# EAGLE design charging_test (EAGLE 5.11)
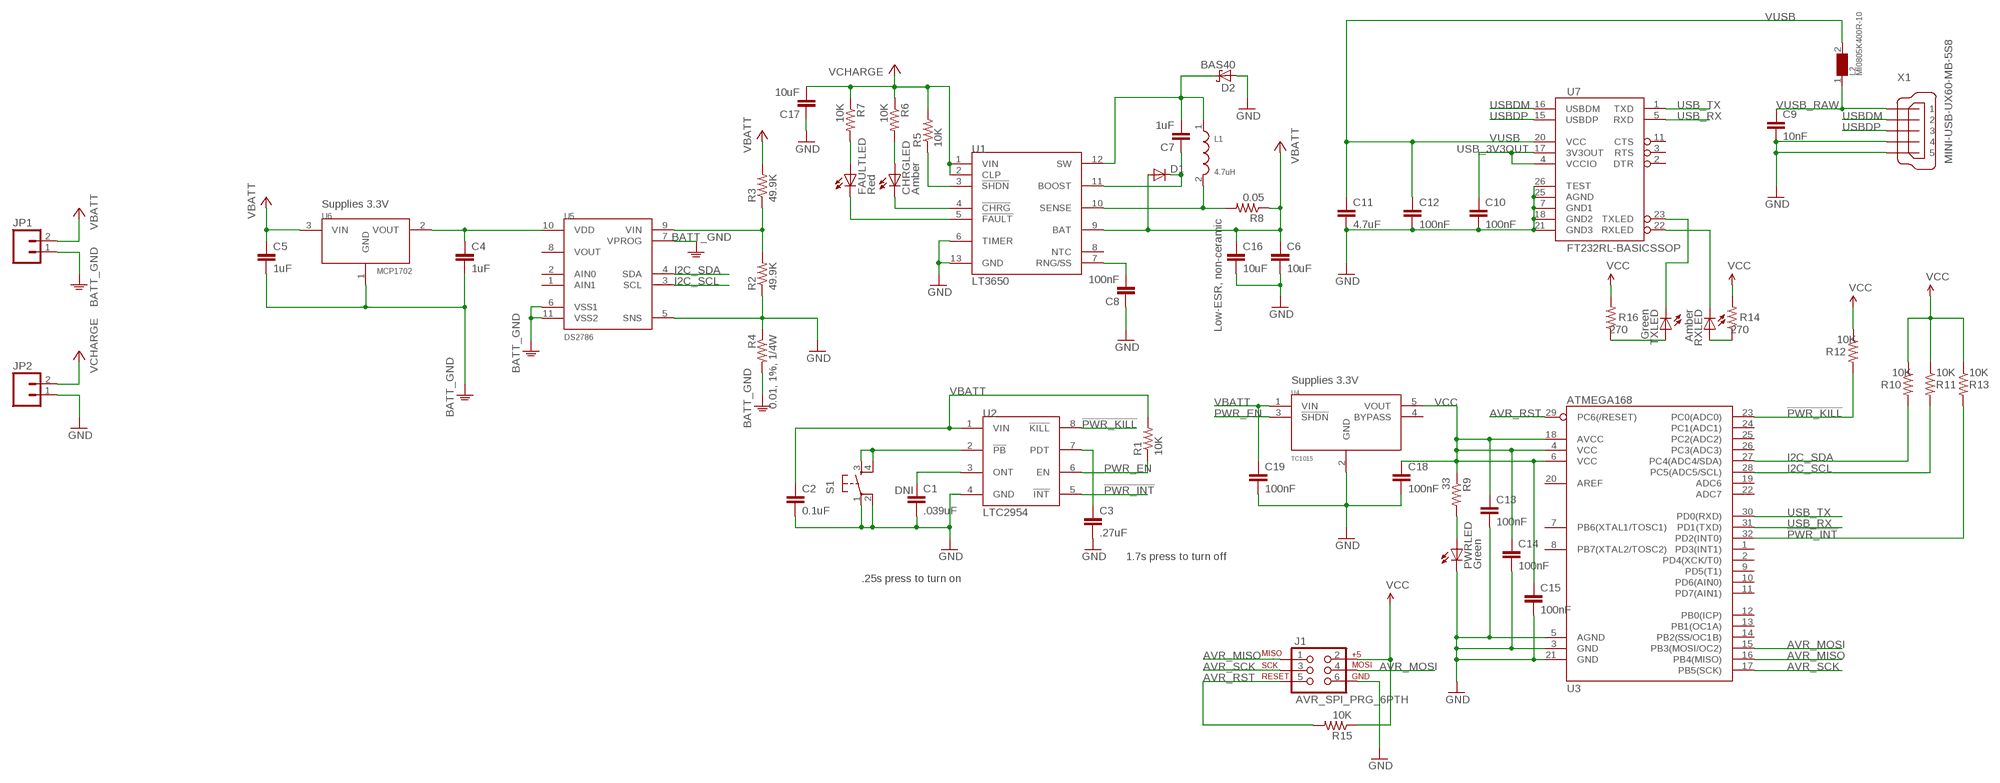
[diagram p0: schematic, sheet 1]

## Parts
C1  .039uF  CAP0603-CAP  [0603-CAP]
C2  0.1uF  CAP0603-CAP  [0603-CAP]
C3  .27uF  CAP0603-CAP  [0603-CAP]
C4  1uF  CAP0603-CAP  [0603-CAP]
C5  1uF  CAP0603-CAP  [0603-CAP]
C6  10uF  CAP0603-CAP  [0603-CAP]
C7  1uF  CAP0603-CAP  [0603-CAP]
C8  100nF  CAP0603-CAP  [0603-CAP]
C9  10nF  CAP0603-CAP  [0603-CAP]
C10  100nF  CAP0603-CAP  [0603-CAP]
C11  4.7uF  CAP0603-CAP  [0603-CAP]
C12  100nF  CAP0603-CAP  [0603-CAP]
C13  100nF  CAP0603-CAP  [0603-CAP]
C14  100nF  CAP0603-CAP  [0603-CAP]
C15  100nF  CAP0603-CAP  [0603-CAP]
C16  10uF  CAP0603-CAP  [0603-CAP]
C17  10uF  CAP0603-CAP  [0603-CAP]
C18  100nF  CAP0603-CAP  [0603-CAP]
C19  100nF  CAP0603-CAP  [0603-CAP]
CHRGLED  Amber  LED0603  [LED-0603]
D1  DIODESMA  [SMA-DIODE]
D2  BAS40  [SOT23]
FAULTLED  Red  LED0603  [LED-0603]
J1  AVR_SPI_PRG_6PTH  [2X3]
JP1  M02LOCK  [1X02_LOCK]
JP2  M02LOCK  [1X02_LOCK]
L1  4.7uH  MPI4040  [MPI4040]
L2  MI0805K400R-10  [0805]
PWRLED  Green  LED0603  [LED-0603]
R1  10K  RESISTOR0603-RES  [0603-RES]
R2  49.9K  RESISTOR0603-RES  [0603-RES]
R3  49.9K  RESISTOR0603-RES  [0603-RES]
R4  0.01, 1%, 1/4W  RESISTOR  [0805]
R5  10K  RESISTOR0603-RES  [0603-RES]
R6  10K  RESISTOR0603-RES  [0603-RES]
R7  10K  RESISTOR0603-RES  [0603-RES]
R8  0.05  RESISTOR0603-RES  [0603-RES]
R9  33  RESISTOR0603-RES  [0603-RES]
R10  10K  RESISTOR0603-RES  [0603-RES]
R11  10K  RESISTOR0603-RES  [0603-RES]
R12  10K  RESISTOR0603-RES  [0603-RES]
R13  10K  RESISTOR0603-RES  [0603-RES]
R14  270  RESISTOR0603-RES  [0603-RES]
R15  10K  RESISTOR0603-RES  [0603-RES]
R16  270  RESISTOR0603-RES  [0603-RES]
RXLED  Amber  LED0603  [LED-0603]
S1  TAC_SWITCHSMD  [TACTILE_SWITCH_SMD]
TXLED  Green  LED0603  [LED-0603]
U1  LT3650  [12-MSOP]
U2  LTC2954  [8-TSOT23]
U3  ATMEGA168  [TQFP32-08]
U4  TC1015  [5-SOT23]
U5  DS2786  [10-TDFN]
U6  MCP1702  [SOT23]
U7  FT232RL-BASICSSOP  [SSOP28DB]
X1  MINI-USB-UX60-MB-5S8  [UX60-MB-5S8]

## Nets
!PWR_INT: R13.2 U2.5(!INT) U3.32(PD2(INT0))
!PWR_KILL: R12.2 U2.8(!KILL) U3.23(PC0(ADC0))
AVR_MISO: J1.1 U3.16(PB4(MISO))
AVR_MOSI: J1.4 U3.15(PB3(MOSI/OC2))
AVR_RST: J1.5 R15.2 U3.29(PC6(/RESET))
AVR_SCK: J1.3 U3.17(PB5(SCK))
BATT_GND: C4.2 C5.2 JP1.1 R4.2 U5.6(VSS1) U5.7(VPROG) U5.11(VSS2) U6.1(GND)
GND: C1.2 C2.2 C3.2 C6.2 C8.1 C9.2 C10.2 C11.2 C12.2 C13.2 C14.2 C15.2 C16.2 C17.1 C18.2 C19.2 D2.1(A) J1.6 JP2.1 PWRLED.C R2.1 R4.1 S1.1 S1.2 U1.6(TIMER) U1.13(GND) U2.4(GND) U3.3(GND) U3.5(AGND) U3.21(GND) U4.2(GND) U5.5(SNS) U7.7(GND1) U7.18(GND2) U7.21(GND3) U7.25(AGND) U7.26(TEST) X1.4 X1.5
I2C_SCL: R11.2 U3.28(PC5(ADC5/SCL)) U5.3(SCL)
I2C_SDA: R10.2 U3.27(PC4(ADC4/SDA)) U5.4(SDA)
N$1: PWRLED.A R9.2
N$2: S1.3 S1.4 U2.2(!PB)
N$3: C4.1 U5.10(VDD) U6.2(VOUT)
N$4: C1.1 U2.3(ONT)
N$5: R2.2 R3.1 U5.9(VIN)
N$6: C7.1 D1.C U1.11(BOOST)
N$7: C3.1 U2.7(PDT)
N$8: R16.1 TXLED.A
N$9: FAULTLED.A R7.2
N$10: R14.1 RXLED.A
N$11: C7.2 D2.3(C) L1.1 U1.12(SW)
N$12: CHRGLED.C U1.4(!CHRG)
N$13: CHRGLED.A R6.2
N$14: C8.2 U1.7(RNG/SS)
N$15: R5.1 U1.3(!SHDN)
N$16: FAULTLED.C U1.5(!FAULT)
N$18: TXLED.C U7.23(TXLED)
N$19: RXLED.C U7.22(RXLED)
PWR_EN: R1.1 U2.6(EN) U4.3(!SHDN)
SENSE: L1.2 R8.2 U1.10(SENSE)
USB_3V3OUT: C10.1 U7.4(VCCIO) U7.17(3V3OUT)
USB_RX: U3.31(PD1(TXD)) U7.5(RXD)
USB_TX: U3.30(PD0(RXD)) U7.1(TXD)
USBDM: U7.16(USBDM) X1.2
USBDP: U7.15(USBDP) X1.3
VBATT: C2.1 C5.1 C6.1 C16.1 C19.1 D1.A JP1.2 R1.2 R3.2 R8.1 U1.9(BAT) U2.1(VIN) U4.1(VIN) U6.3(VIN)
VCC: C13.1 C14.1 C15.1 C18.1 J1.2 R9.1 R10.1 R11.1 R12.1 R13.1 R14.2 R15.1 R16.2 U3.4(VCC) U3.6(VCC) U3.18(AVCC) U4.5(VOUT)
VCHARGE: C17.2 JP2.2 R5.2 R6.1 R7.1 U1.1(VIN) U1.2(CLP)
VUSB: C11.1 C12.1 L2.2 U7.20(VCC)
VUSB_RAW: C9.1 L2.1 X1.1
Unconnected: U1.8(NTC) U3.1(PD3(INT1)) U3.2(PD4(XCK/T0)) U3.7(PB6(XTAL1/TOSC1)) U3.8(PB7(XTAL2/TOSC2)) U3.9(PD5(T1)) U3.10(PD6(AIN0)) U3.11(PD7(AIN1)) U3.12(PB0(ICP)) U3.13(PB1(OC1A)) U3.14(PB2(SS/OC1B)) U3.19(ADC6) U3.20(AREF) U3.22(ADC7) U3.24(PC1(ADC1)) U3.25(PC2(ADC2)) U3.26(PC3(ADC3)) U4.4(BYPASS) U5.1(AIN1) U5.2(AIN0) U5.8(VOUT) U7.2(DTR) U7.3(RTS) U7.11(CTS)

## Notes on the sheet
- Supplies 3.3V
- Low-ESR, non-ceramic
- Supplies 3.3V
- DNI
- 1.7s press to turn off
- .25s press to turn on

## Library data of the parts
C1-C19 = SparkFun:CAP: Capacitor Standard 0603 ceramic capacitor, and 0.1" leaded capacitor.
CHRGLED FAULTLED PWRLED RXLED TXLED = SparkFun:LED: LEDs Standard schematic elements and footprints for 5mm, 3mm, 1206, and 0603 sized LEDs. 5mm - Spark Fun Electronics SKU : COM-00529 (and others)
D1 = SparkFun:DIODE: Diode These are standard reverse protection diodes and small signal diodes. SMA package can handle up to about 1A. SOD-323 can handle about 200mA. What the SOD-323 package when ordering, there are some mfgs out there that are 5-pin packages.
D2 = diode:BAS40: Silicon Schottky Diodes General-purpose diode for high-speed switching
J1 = SparkFun:AVR_SPI_PRG_6: AVR ISP 6 Pin This is the reduced ISP connector for AVR programming. Common on Arduino. This footprint will take up less PCB space and can be used with a 10-pin to 6-pin adapter such as SKU: BOB-08508
JP1 JP2 = SparkFun:M02: Header 2 Standard 2-pin 0.1" header. Use with straight break away headers (SKU : PRT-00116), right angle break away headers (PRT-00553), swiss pins (PRT-00743), machine pins (PRT-00117), and female headers (PRT-00115). Molex polarized connector foot print use with SKU : PRT-08233 with associated crimp pins and housings.
L1 = kwoo:MPI4040: MPI4040 series High-current, high-frequency miniature power inductors
L2 = kwoo:MI0805K400R-10
R1-R16 = SparkFun:RESISTOR: Resistor Basic schematic elements and footprints for 0603, 1206, and PTH 1/10th watt (small) resistors.
S1 = SparkFun:TAC_SWITCH: Momentary Switch Button commonly used for reset or general input. Spark Fun Electronics SKU : COM-00097
U1 = kwoo:LT3650: High-voltage, 2-Amp, monolithic Li-Ion battery charger
U2 = kwoo:LTC2954
U3 = SparkFun:ATMEGA168
U4 = kwoo:TC1015
U5 = kwoo:DS2786
U6 = kwoo:MCP1702
U7 = SparkFun:FT232RL-BASIC: USB UART This is the simplified version of the FT232RL unit. Only what you need, nothing you don't. Spark Fun Electronics SKU : COM-00650
X1 = kwoo:MINI-USB-: MINI USB Connector Source: http://www.hirose.co.jp/cataloge_hp/e24000019.pdf; OC_FARNELL: unknown; OC_NEWARK: unknown

## Board
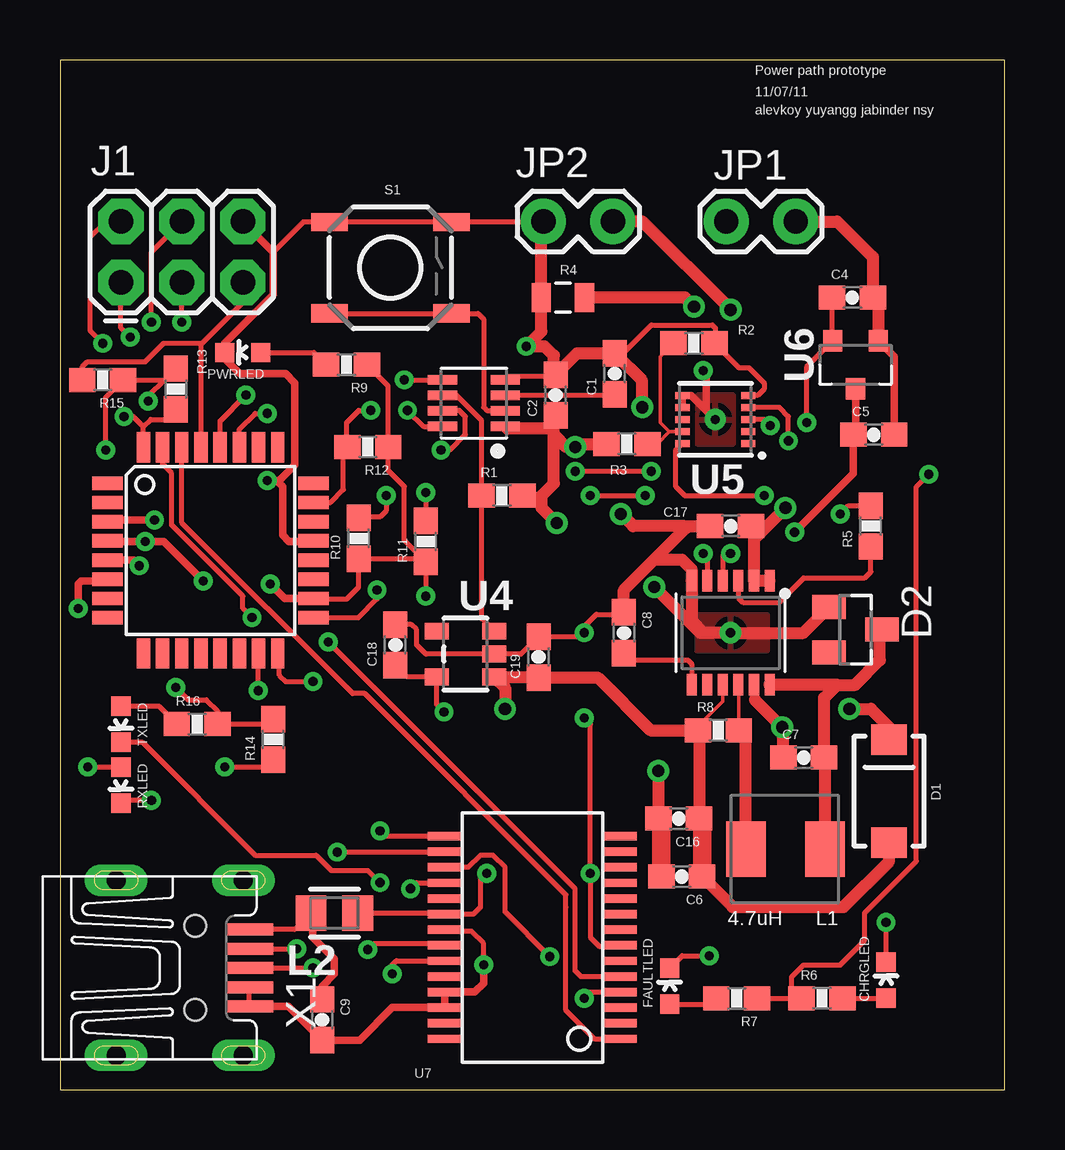
[diagram p1: board, top side]
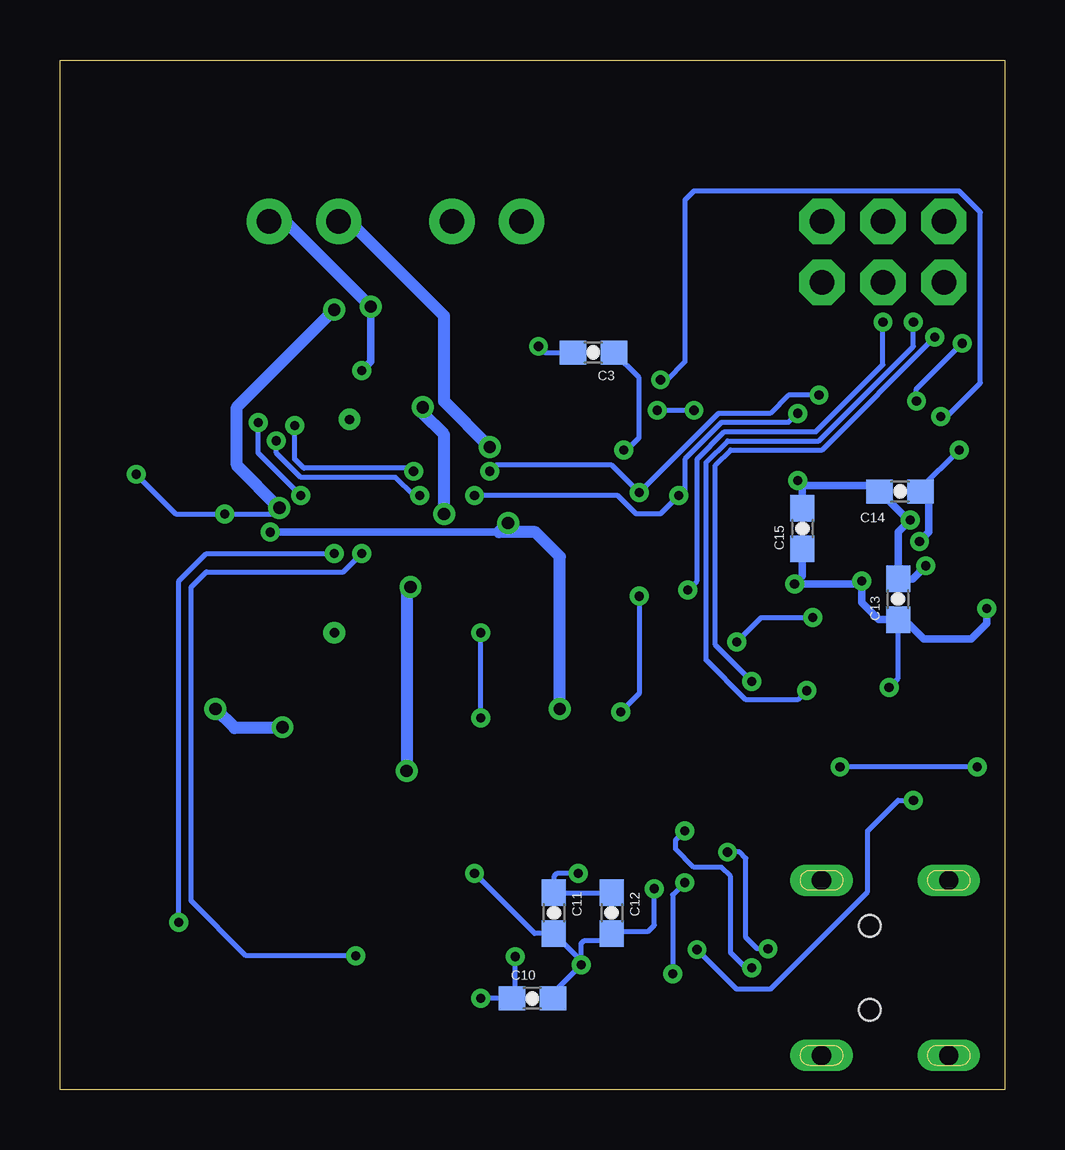
[diagram p2: board, bottom side, seen from below]

Size 39.37 x 42.93 mm. Coordinates in mm from the lower left corner, seen from the top.
Outline: 0,0 39.37,0 39.37,42.93 0,42.93 0,0
Copper layers (1*16): Top 0.035mm / dielectric 1.5mm / Bottom 0.035mm
Design rules "default *": minimum track width 6mil, minimum drill 13mil, track to track 6mil, track to pad 6mil, pad to pad 6mil, via to via 6mil, smd to smd 6mil, copper to edge 10mil, drill to drill 8mil, minimum pad ring 10mil, minimum via ring 8mil, stop-mask expansion 4mil, vias tented up to drill 0mil, thermal gap 10mil

### Footprints (pad centres in the part's own frame; a part is rotated, then mirrored left to right if it is on the bottom)
0603-CAP = smd 1.1 x 1: 1 -0.85,0; 2 0.85,0
LED-0603 = smd 0.8 x 0.8: A 0,-0.75; C 0,0.75
SMA-DIODE = smd 1.27 x 1.47: A -2.15,0; C 2.15,0
SOT23 = smd 1 x 1.4: 1 -0.95,-1.1; 2 0.95,-1.1; 3 0,1.1
2X3 = drill 1.016 pad 1.88 octagon: 1 0,0; 2 0,2.54; 3 2.54,0; 4 2.54,2.54; 5 5.08,0; 6 5.08,2.54
1X02_LOCK = drill 1.016 pad 1.88 round: 1 -0.178,0; 2 2.718,0
MPI4040 = smd 2.3 x 1.65: 1 0,1.65; 2 0,-1.65
0805 = smd 1.285 x 1.47: 1 -0.973,0; 2 0.973,0
0603-RES = smd 1.1 x 1: 1 -0.85,0; 2 0.85,0
0805' = smd 0.8 x 1.2: 1 -0.9,0; 2 0.9,0
TACTILE_SWITCH_SMD = smd 1.524 x 0.762: 1 -2.54,1.905; 2 2.54,1.905; 3 -2.54,-1.905; 4 2.54,-1.905
12-MSOP = smd 0.42 x 0.889: 1 -1.625,-2.17; 2 -0.975,-2.17; 3 -0.325,-2.17; 4 0.325,-2.17; 5 0.975,-2.17; 6 1.625,-2.17; 7 1.625,2.17; 8 0.975,2.17; 9 0.325,2.17; 10 -0.325,2.17; 11 -0.975,2.17; 12 -1.625,2.17 | drill 0.4 round: 13 0,0
8-TSOT23 = smd 0.4 x 1.22: 1 -0.975,-1.31; 2 -0.325,-1.31; 3 0.325,-1.31; 4 0.975,-1.31; 5 0.975,1.31; 6 0.325,1.31; 7 -0.325,1.31; 8 -0.975,1.31
TQFP32-08 = smd 1.27 x 0.559: 1 -4.293,2.8; 2 -4.293,2; 3 -4.293,1.2; 4 -4.293,0.4; 5 -4.293,-0.4; 6 -4.293,-1.2; 7 -4.293,-2; 8 -4.293,-2.8; 17 4.293,-2.8; 18 4.293,-2; 19 4.293,-1.2; 20 4.293,-0.4; 21 4.293,0.4; 22 4.293,1.2; 23 4.293,2; 24 4.293,2.8 | smd 0.559 x 1.27: 9 -2.8,-4.293; 10 -2,-4.293; 11 -1.2,-4.293; 12 -0.4,-4.293; 13 0.4,-4.293; 14 1.2,-4.293; 15 2,-4.293; 16 2.8,-4.293; 25 2.8,4.293; 26 2,4.293; 27 1.2,4.293; 28 0.4,4.293; 29 -0.4,4.293; 30 -1.2,4.293; 31 -2,4.293; 32 -2.8,4.293
5-SOT23 = smd 0.7 x 1: 1 -0.95,-1.2; 2 0,-1.2; 3 0.95,-1.2; 4 0.95,1.2; 5 -0.95,1.2
10-TDFN = smd 0.6 x 0.3: 1 -1.37,1; 2 -1.37,0.5; 3 -1.37,0; 4 -1.37,-0.5; 5 -1.37,-1; 6 1.37,-1; 7 1.37,-0.5; 8 1.37,0; 9 1.37,0.5; 10 1.37,1 | drill 0.381 round: 11 0,0
SOT23' = smd 0.8 x 0.9: 1 -0.95,-1; 2 0.95,-1; 3 0,1
SSOP28DB = smd 0.348 x 1.397: 1 -4.225,-3.656; 2 -3.575,-3.656; 3 -2.925,-3.656; 4 -2.275,-3.656; 5 -1.625,-3.656; 6 -0.975,-3.656; 7 -0.325,-3.656; 8 0.325,-3.656; 9 0.975,-3.656; 10 1.625,-3.656; 11 2.275,-3.656; 12 2.925,-3.656; 13 3.575,-3.656; 14 4.225,-3.656; 15 4.225,3.656; 16 3.575,3.656; 17 2.925,3.656; 18 2.275,3.656; 19 1.625,3.656; 20 0.975,3.656; 21 0.325,3.656; 22 -0.325,3.656; 23 -0.975,3.656; 24 -1.625,3.656; 25 -2.275,3.656; 26 -2.925,3.656; 27 -3.575,3.656; 28 -4.225,3.656
UX60-MB-5S8 = smd 2 x 0.5: 1 8.65,1.6; 2 8.65,0.8; 3 8.65,0; 4 8.65,-0.8; 5 8.65,-1.6 | drill 0.8 long: M1 3.1,-3.65; M2 3.1,3.65; M3 8.4,3.65; M4 8.4,-3.65 | hole 0.9: 6.4,-1.75; 6.4,1.75

### Placement (x,y rotation side)
C1  23.11,29.84 90 top
C2  20.65,28.96 90 top
C3  17.14,30.73 180 bottom
C4  33.02,33.02 0 top
C5  33.91,27.3 0 top
C6  25.91,8.89 180 top
C7  30.99,13.84 0 top
C8  23.5,19.05 270 top
C9  10.92,2.92 270 top
C10  19.68,3.81 0 bottom
C11  18.8,7.37 270 bottom
C12  16.38,7.37 270 bottom
C13  4.45,20.45 90 bottom
C14  4.37,24.94 180 bottom
C15  8.43,23.39 90 bottom
C16  25.78,11.3 180 top
C17  27.94,23.5 0 top
C18  13.97,18.54 90 top
C19  19.94,18.03 90 top
CHRGLED  34.42,4.57 0 top
D1  34.54,12.45 90 top
D2  33.15,19.18 270 top
FAULTLED  25.4,4.32 0 top
J1  2.54,33.66 0 top
JP1  30.48,36.2 180 top
JP2  20.32,36.2 0 top
L1  30.23,10.03 270 top
L2  11.43,7.37 0 top
PWRLED  7.62,30.73 90 top
R1  18.41,24.77 0 top
R2  26.42,31.11 180 top
R3  23.62,26.92 180 top
R4  0.01, 1%, 1/4W  [0805']  20.95,33.02 0 top
R5  33.78,23.5 90 top
R6  31.75,3.81 0 top
R7  28.19,3.81 180 top
R8  27.43,14.99 0 top
R9  11.94,30.23 180 top
R10  12.45,22.99 90 top
R11  15.24,22.86 90 top
R12  12.83,26.8 180 top
R13  4.83,29.21 270 top
R14  8.89,14.61 90 top
R15  1.78,29.59 180 top
R16  5.71,15.24 0 top
RXLED  2.54,12.7 180 top
S1  13.77,34.26 0 top
TXLED  2.54,15.24 180 top
U1  27.94,19.05 180 top
U2  17.25,28.63 90 top
U3  6.27,22.48 0 top
U4  16.89,18.16 90 top
U5  27.3,27.94 180 top
U6  MCP1702  [SOT23']  33.15,30.23 180 top
U7  19.68,6.35 90 top
X1  -0.76,5.08 0 top

### Tracks (layer width: path | path; a pad name or v marks a point on that pad's centre or on a via)
!PWR_INT  (via drill 0.38)
  Top 0.203: U3.32 3.47,27.64 | 3.47,27.64 3.05,28.07 v2.67,28.07 | v14.35,29.59 15.93,29.59 U2.5 | 3.47,27.64 3.77,27.94 4.41,27.94 R13.2
  Bottom 0.203: v2.67,28.07 2.41,28.07 1.02,29.46 1.02,36.58 1.91,37.47 12.95,37.47 13.34,37.08 13.34,30.35 14.1,29.59 v14.35,29.59
!PWR_KILL  (via drill 0.38)
  Top 0.203: U3.23 11.27,24.48 11.81,25.02 11.81,26.63 R12.2 | U2.8 15.15,27.65 v14.48,28.32 | R12.2 11.68,27.09 | v12.95,28.32 12.45,28.32 11.94,27.81 11.94,26.84 R12.2
  Bottom 0.203: v12.95,28.32 v14.48,28.32
AVR_MISO  (via drill 0.38)
  Top 0.203: J1.1 2.54,31.75 v2.92,31.37 | 9.1,18.16 U3.16 9.14,18.12 9.14,17.27 9.4,17.02 v10.54,17.02
  Bottom 0.203: v2.92,31.37 7.62,26.67 11.43,26.67 12.06,26.04 12.06,18.54 v10.54,17.02
AVR_MOSI  (via drill 0.38)
  Top 0.203: J1.4 3.81,34.92 v3.81,32 | v8.26,16.64 8.26,18.17 U3.15
  Bottom 0.203: v8.26,16.64 8.64,16.26 10.79,16.26 12.45,17.91 12.45,26.16 11.56,27.05 7.75,27.05 3.81,30.99 v3.81,32
AVR_RST
  Top 0.203: J1.5 7.62,32.8 5.87,31.06 | 5.87,31.06 U3.29 | R15.2 0.93,30.14 1.14,30.35 3.56,30.35 4.32,31.11 5.82,31.11 5.87,31.06
AVR_SCK  (via drill 0.38)
  Top 0.203: v5.08,32 J1.3 | U3.17 12.44,19.68 13.21,20.45 v13.21,20.83
  Bottom 0.203: v5.08,32 5.08,30.23 7.87,27.43 11.68,27.43 12.83,26.29 12.83,21.21 v13.21,20.83
BATT_GND  (via drill 0.38, 0.51)
  Top 0.305: v26.8,29.97 26.92,29.84 26.92,28.32 U5.11 26.3,28.94 U5.6 U5.7 | C5.2 34.76,30.56 U6.1 | C4.2 34.1,32.79
  Top 0.508: R4.2 26.04,33.02 v26.42,32.64 | 34.1,32.79 U6.1 | C4.2 33.87,34.71 32.38,36.2 JP1.1
  Bottom 0.305: v26.42,32.64 26.42,30.35 v26.8,29.97
  Bottom 0.508: v26.42,32.64 29.97,36.2 JP1.1
  pour Top: 26.54,28.96 26.54,26.92 28.07,26.92 28.07,28.96
GND  (via drill 0.38, 0.51)
  Top 0.203: X1.5 X1.4 | U7.26 | U7.21 16.1,6.6 17.14,6.6 17.65,6.1 v17.65,5.21 | v8.64,25.4 9.02,25.4 | 10.55,22.86 U3.21 | 16.02,8.64 U7.18 14.85,8.62 v14.61,8.38 | PWRLED.C 6.87,30.47 | U2.4 18.67,29.72 20.56,29.72 C2.2 20.57,29.88 | 8.89,34.92 10.13,36.17 S1.1 S1.2 20.12,36.17 JP2.1 20.05,36.11 | U5.5 29.07,28.94 29.34,29.21 29.34,29.46 28.7,30.1 28.28,30.1 R2.1 27.3,31.15 27.3,31.75 27.18,31.88 24.64,31.88 23.46,30.7 C1.2 | 26.8,19.05 U1.13 | C8.1 23.41,19.81 22.35,19.81 21.84,19.3 v21.84,19.05 21.68,18.88 C19.2 19.22,18.16 U4.2 15.24,18.16 14.86,18.54 14.86,19.18 14.64,19.39 C18.2 | 26.16,23.5 26.1,23.43 26.04,23.5 | 2.05,23.75 U3.3 | U7.7 23.29,5.97 22.48,5.97 22.1,6.35 v22.1,9.02 22.1,15.24 v21.84,15.49
  Top 0.305: X1.5 9.22,3.48 9.51,3.48 C9.2 12.48,2.07 13.84,3.43 U7.26 | U7.26 U7.25 17.28,4.08 17.65,4.45 v17.65,5.21 | 9.02,25.4 9.27,25.15 9.27,23.11 9.53,22.86 10.55,22.86 | PWRLED.C 6.87,31.13 8.89,33.15 8.89,34.92 J1.6 | v8.64,25.4 9.14,25.4 9.78,26.04 9.78,29.46 9.4,29.84 7.49,29.84 6.87,30.47 | v3.94,23.75 2.05,23.75 | v3.3,21.84 3.07,22.08 U3.5
  Top 0.508: C2.2 21.54,30.7 C1.2 24.26,29.55 v24.26,28.45 | 20.57,29.88 20.57,30.61 20.19,30.99 v19.43,30.99 20.05,31.61 R4.1 20.05,36.11 | 24.77,22.1 25.91,22.1 26.32,21.69 U1.6 26.32,19.53 26.8,19.05 | 24.77,22.1 23.5,20.83 C8.1 | 26.16,23.5 C17.1 | 24.77,22.1 26.1,23.43 | 25.06,11.18 C16.2 v24.93,13.3 | D2.1 30.97,19.05 U1.13 26.67,19.05 v24.77,20.95 | 26.04,23.5 23.88,23.5 v23.37,24
  Top 0.762: 25.06,11.18 C6.2
  Bottom 0.203: 5.27,24.89 C14.2 5.47,25.2 | C3.2 19.18,30.73 v19.43,30.99 | v21.84,15.49 v21.84,19.05 | C10.2 18.8,3.85 18.8,4.06 v17.65,5.21 | v17.65,5.21 17.65,6.1 17.53,6.22 16.68,6.22 C12.2 16.22,6.67 U7.21 15.96,6.6 14.86,6.6 14.61,6.86 v14.61,8.38 | v17.65,5.21 17.65,5.37 C11.2 19.6,6.52 v22.1,9.02
  Bottom 0.305: 8.43,25.2 C15.2 | v8.64,25.4 8.43,25.2 | 8.43,25.2 5.47,25.2 | C14.2 4.03,23.75 v3.94,23.75 4.45,23.24 C13.2 3.85,21.3 v3.3,21.84
  Bottom 0.508: v24.93,13.3 24.93,20.79 v24.77,20.95 | v23.37,24 23.37,27.3 24.26,28.19 v24.26,28.45
  pour Top: 29.46,19.81 29.46,18.29 26.54,18.29 26.54,19.81
I2C_SCL  (via drill 0.38)
  Top 0.203: v15.24,24.89 R11.2 | v7.75,28.96 6.67,27.88 U3.28 | U5.3 29.34,27.94 v29.59,27.69 | v21.46,25.78 v24.64,25.78
  Bottom 0.203: v7.75,28.96 9.02,28.96 9.78,28.19 11.94,28.19 v15.24,24.89 16.38,26.04 21.21,26.04 v21.46,25.78 | v29.59,27.69 29.59,26.29 29.21,25.91 24.77,25.91 v24.64,25.78
I2C_SDA  (via drill 0.38)
  Top 0.203: U3.27 7.47,27.54 8.13,28.19 v8.64,28.19 | v13.59,24.77 13.59,24.13 13.34,23.88 12.48,23.88 R10.2 | U5.4 29.98,28.44 30.35,28.07 v30.35,27.05 | v22.1,24.77 v24.38,24.77
  Bottom 0.203: v8.64,28.19 9.02,27.81 11.81,27.81 13.34,26.29 13.34,25.02 v13.59,24.77 14.35,24 15.37,24 16.13,24.77 v22.1,24.77 | v30.35,27.05 30.35,26.54 29.34,25.53 25.4,25.53 24.64,24.77 v24.38,24.77
N$1
  Top 0.203: PWRLED.A 10.58,30.73 R9.2
N$2
  Top 0.203: S1.3 S1.4 17.42,32.36 17.65,32.13 17.65,28.45 17.78,28.32 18.54,28.32 U2.2
N$3  (via drill 0.38)
  Top 0.203: v29.34,24.77 26.04,24.77 25.65,25.15 25.65,26.66 U5.10 | 32.17,31.25 C4.1 | U6.2 31.11,30.14 v31.11,27.81
  Top 0.305: U6.2 32.17,31.25
  Bottom 0.203: v31.11,27.81 31.11,26.54 v29.34,24.77
N$4
  Top 0.203: U2.3 23.07,28.95 C1.1
N$5
  Top 0.152: R2.2 25.02,30.57 25.02,27.81 25.39,27.44 | 25.39,27.44 U5.9 | 25.39,27.44 24.88,26.92 R3.1
  Top 0.203: U5.9
N$6  (via drill 0.51)
  Top 0.381: 28.96,16.26 28.96,16.84 U1.11
  Top 0.508: D1.C 34.54,15.11 33.78,15.88 v32.89,15.88 | C7.1 30.14,15.07 v30.1,15.11 28.96,16.26
  Bottom 0.508: v32.89,15.88 32.09,15.07 30.14,15.07 v30.1,15.11
N$7  (via drill 0.38)
  Top 0.203: v15.88,26.67 16.26,26.67 16.89,27.3 16.89,28.07 16.64,28.32 15.96,28.32 U2.7
  Bottom 0.203: C3.1 15.24,29.68 15.24,27.18 15.75,26.67 v15.88,26.67
N$8
  Top 0.203: TXLED.A 4.12,15.99 R16.1
N$9
  Top 0.203: FAULTLED.A 27.1,3.57 R7.2
N$10  (via drill 0.38)
  Top 0.203: v6.87,13.45 8.59,13.45 R14.1 | v1.16,13.45 RXLED.A
  Bottom 0.203: v1.16,13.45 v6.87,13.45
N$11
  Top 0.508: 32.38,16.88 U1.12 | 32.38,16.88 33.14,16.88 34.16,17.91 34.16,19.09 D2.3 | 32.38,16.88 31.84,16.33 C7.2 31.88,13.8 L1.1
N$12  (via drill 0.38)
  Top 0.203: U1.4 27.61,22.28 27.69,22.35 v27.94,22.35 | CHRGLED.C v34.42,6.99
  Bottom 0.203: v27.94,22.35 33.27,22.35 34.42,21.21 v34.42,6.99
N$13
  Top 0.203: R6.2 34.41,3.81 CHRGLED.A
N$14
  Top 0.203: U1.7 26.32,17.75 26.16,17.91 23.79,17.91 C8.2
N$15
  Top 0.203: U1.3 28.27,20.5 28.45,20.32 29.97,20.32 30.99,21.34 33.53,21.34 33.78,21.59 R5.1
N$16  (via drill 0.38)
  Top 0.203: U1.5 26.96,22.18 v26.8,22.35 | v27.05,5.59 25.92,5.59 FAULTLED.C
  Bottom 0.203: v26.8,22.35 27.56,21.59 33.27,21.59 33.91,20.95 33.91,7.87 31.62,5.59 v27.05,5.59
N$18  (via drill 0.38)
  Top 0.203: v13.34,8.64 12.83,9.14 11.3,9.14 10.67,9.78 8.13,9.78 3.42,14.49 TXLED.C | v13.84,4.83 13.84,5.21 14.01,5.38 U7.23
  Bottom 0.203: v13.34,8.64 13.84,8.13 v13.84,4.83
N$19  (via drill 0.38)
  Top 0.203: RXLED.C 2.65,12.06 v3.81,12.06 | U7.22 15.96,6.1 13.08,6.1 v12.83,5.84
  Bottom 0.203: v3.81,12.06 4.45,12.06 5.71,10.79 5.71,8.26 9.78,4.19 11.18,4.19 v12.83,5.84
PWR_EN
  Top 0.203: U2.6 16.52,28.95 17.57,27.9 R1.1 17.57,19.64 U4.3
SENSE
  Top 0.152: R8.2 28.28,16.86 U1.10
  Top 0.508: L1.2 28.58,14.69 R8.2
USB_3V3OUT  (via drill 0.38)
  Top 0.203: v21.84,3.81 22.11,4.08 U7.4 | U7.17 17.02,9.27 17.53,9.78 18.03,9.78 18.54,9.27 18.54,7.42 v20.41,5.55
  Bottom 0.203: v21.84,3.81 C10.1 20.41,3.94 v20.41,5.55
USB_RX  (via drill 0.38)
  Top 0.203: v11.18,18.67 21.46,8.38 21.46,4.95 21.69,4.72 U7.5 | v8,19.68 7.62,20.07 7.62,20.57 4.66,23.54 4.66,25.7 4.27,26.08 U3.31
  Bottom 0.203: v8,19.68 10.16,19.68 v11.18,18.67
USB_TX
  Top 0.203: U3.30 5.07,23.63 12.19,16.51 12.7,16.51 21.08,8.13 21.08,7.62 21.08,3.3 22.26,2.12 U7.1
USBDM  (via drill 0.38)
  Top 0.203: X1.2 v9.87,5.88 | v11.56,9.91 16.01,9.91 U7.16
  Bottom 0.203: v9.87,5.88 10.32,5.88 10.79,6.35 10.79,9.65 11.05,9.91 v11.56,9.91
USBDP  (via drill 0.38)
  Top 0.203: X1.3 v10.54,5.08 | v13.34,10.79 13.55,10.57 U7.15
  Bottom 0.203: v10.54,5.08 10.79,5.08 11.43,5.71 11.43,8.89 11.81,9.27 12.95,9.27 13.72,10.03 13.72,10.41 v13.34,10.79
VBATT  (via drill 0.38, 0.51)
  Top 0.152: R8.1 26.58,15.15 27.61,16.18 U1.9
  Top 0.203: 20.45,27.56 20.65,27.76 C2.1 20.57,28.03 | 18.65,27.56 U2.1
  Top 0.305: 20.07,24.77 R1.2 | 18.12,17.18 U4.1 | U6.3 33.15,27.39 C5.1 33.06,25.69 v30.61,23.24
  Top 0.508: 20.45,27.56 18.65,27.56 | 20.57,27.3 20.57,25.27 20.07,24.77 20.07,24.26 v20.7,23.62 | 20.57,27.3 20.57,28.03 | 18.12,17.18 C19.1 22.4,17.18 24.6,14.99 R8.1 26.63,14.94 C16.1 26.76,11.18 | v18.54,15.88 18.54,16.76 U4.1 | 20.57,27.3 21.08,26.8 v21.46,26.8 21.59,26.92 R3.2 | D1.A 34.54,9.53 32.64,7.62 28.03,7.62 C6.1
  Top 0.762: 26.76,11.18 C6.1
  Bottom 0.305: 21.08,23.24 v30.61,23.24
  Bottom 0.508: v21.46,26.8 23.37,28.7 23.37,32.26 27.3,36.2 JP1.2 | v20.7,23.62 21.08,23.24 19.56,23.24 18.54,22.23 v18.54,15.88
VCC  (via drill 0.38)
  Top 0.203: R14.2 8.68,15.24 R16.2 6.57,15.79 6.1,16.26 5.33,16.26 v4.83,16.76 | 1.91,21.21 U3.6 | 2.54,22.86 2.52,22.88 U3.4 | J1.2 1.91,36.2 1.27,35.56 1.27,31.62 v1.78,31.11 | U3.18 10.6,20.45 11.94,20.45 12.45,20.95 R10.1 15.11,22.14 R11.1 | R11.1 14.35,22.9 14.35,25.15 13.68,25.82 R12.1 13.68,29.34 R9.1 | R11.1 v15.24,20.57 | v1.91,26.67 1.91,28.87 R15.1 4.36,29.59 | 4.36,29.59 R13.1 | v3.68,28.7 3.68,28.92 4.36,29.59 | C18.1 14.45,17.21 U4.5 15.69,16.06 v16,15.75
  Top 0.305: v0.76,20.07 0.76,21.08 0.89,21.21 1.91,21.21 | 2.54,22.86 v3.56,22.86 4.32,22.86 v5.97,21.21 | v8.76,21.08 9.37,20.48 U3.18
  Bottom 0.203: v1.91,26.67 3.52,25.06 C14.1 3.17,24.6 | v1.78,31.11 3.68,29.21 v3.68,28.7 | v4.83,16.76 4.45,17.14 C13.1 | v15.24,20.57 15.24,16.51 v16,15.75
  Bottom 0.305: v0.76,20.07 0.76,19.43 1.4,18.8 3.39,18.8 4.19,19.6 C13.1 5.25,19.6 5.97,20.32 v5.97,21.21 6.1,21.08 v8.76,21.08 8.43,21.41 C15.1 | 3.17,24.6 3.17,23.24 v3.56,22.86
VCHARGE  (via drill 0.38, 0.51)
  Top 0.203: R5.2 32.85,24.34 v32.51,24 | R7.1 30.48,3.81 | 30.48,3.81 R6.1 | 30.48,3.81 30.48,4.7 30.99,5.21 32.51,5.21 33.53,6.22 33.53,7.37 35.69,9.53 35.69,25.15 v36.2,25.65
  Top 0.508: 29.46,23.5 C17.2 | v30.23,24.26 29.46,23.5 | v27.94,32.51 24.26,36.2 JP2.2 | 29.46,23.5 28.91,22.95 U1.2 U1.1
  Bottom 0.203: v30.23,24.26 30.48,24 v32.51,24 34.54,24 v36.2,25.65
  Bottom 0.508: v30.23,24.26 32,26.04 32,28.45 v27.94,32.51
VUSB  (via drill 0.38)
  Top 0.203: L2.2 15.99,7.37 U7.20 17.23,7.33 17.53,7.62 17.53,8.76 v17.78,9.02
  Bottom 0.203: C12.1 C11.1 18.8,8.89 18.67,9.02 v17.78,9.02
VUSB_RAW
  Top 0.203: 10.54,7.28 L2.1 9.77,6.68 X1.1
  Top 0.305: 10.54,7.28 10.54,6.35 11.43,5.46 11.43,4.83 10.92,4.32 C9.1

### Text on the board
tNames: Power path prototype | 11/07/11 | alevkoy yuyangg jabinder nsy
tValues: .01 | U1 | USB